# Altium project Top.PrjPCB
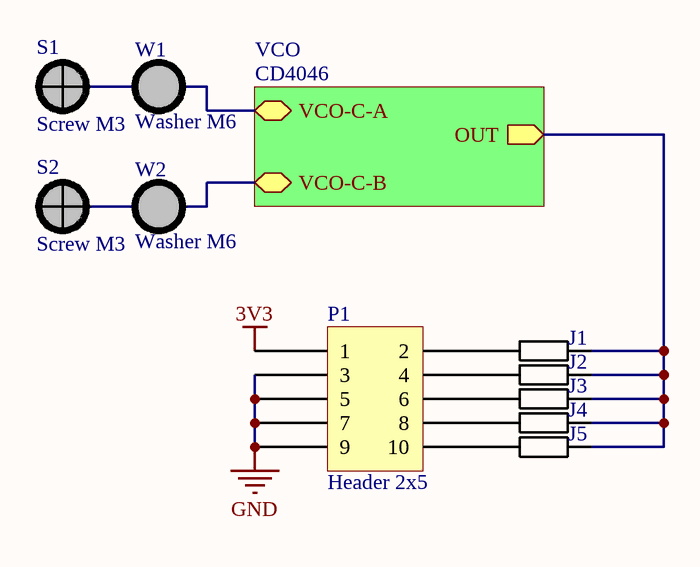
[diagram p0: Top.SchDoc]
2 sheets, 14 parts. Net scope: hierarchical (ports join the sheet entries above them; power ports are global).
Board files: PCB.PcbDoc, Multi-Nutzen.PcbDoc, Multi-Nutzen 2x3.PcbDoc, Multi-Nutzen 39.PcbDoc, Multi-Nutzen 4+3+6+2.PcbDoc
Sheets:
  Top.SchDoc
    CD4046 = VCO.SchDoc

## Sheet Top.SchDoc
size A4

### Parts
J1  (no value)  [R 0805 / 2012 wide]
J2  (no value)  [R 0805 / 2012 wide]
J3  (no value)  [R 0805 / 2012 wide]
J4  (no value)  [R 0805 / 2012 wide]
J5  (no value)  [R 0805 / 2012 wide]
P1  Header 2x5  [Header 2x5 IDC-10S]
S1  Screw M3  [Screw M3]
S2  Screw M3  [Screw M3]
W1  Washer M6  [Washer M6]
W2  Washer M6  [Washer M6]

### Sub-sheets
CD4046 = VCO: VCO-C-A (bidir), VCO-C-B (bidir), OUT (out)

### Nets
3V3: P1.1
GND: P1.3 P1.5 P1.7 P1.9
Frequency-Out: J1.2 J2.2 J3.2 J4.2 J5.2 ; sheet CD4046/OUT
NetJ1_1: J1.1 P1.2
NetJ2_1: J2.1 P1.4
NetJ3_1: J3.1 P1.6
NetJ4_1: J4.1 P1.8
NetJ5_1: J5.1 P1.10

### Library data of the parts
J1-J5 = Resistor

## Sheet VCO.SchDoc
size A4
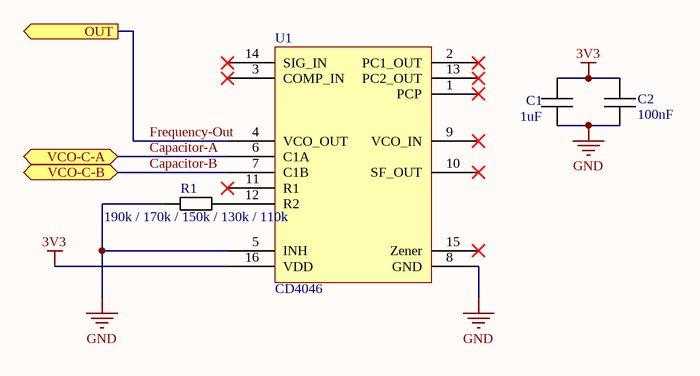
[diagram p1: VCO.SchDoc]

### Parts
C1  1uF  [C 0805 / 2012]
C2  100nF  [C 0805 / 2012]
R1  190k / 170k / 150k / 130k / 110k  [R 0805 / 2012]
U1  CD4046  [SOIC-16]

### Ports
OUT (out), VCO-C-A (bidir), VCO-C-B (bidir)

### Nets
3V3: C1.1 C2.1 U1.16(VDD)
GND: C1.2 C2.2 R1.2 U1.5(INH) U1.8(GND)
Capacitor-A: U1.6(C1A) ; port VCO-C-A
Capacitor-B: U1.7(C1B) ; port VCO-C-B
Frequency-Out: U1.4(VCO_OUT) ; port OUT
NetR1_1: R1.1 U1.12(R2)

Not connected (* = marked no-connect by the designer): U1 1(PCP)* 2(PC1_OUT)* 3(COMP_IN)* 9(VCO_IN)* 10(SF_OUT)* 11(R1)* 13(PC2_OUT)* 14(SIG_IN)* 15(Zener)*

### Library data of the parts
C1 C2 = Capacitor
R1 = Resistor
U1 = CD4046: PLL / VCO

## Nets that join several sheets
3V3: Top (P1.1), VCO (C1.1 C2.1 U1.16)
GND: Top (P1.3 P1.5 P1.7 P1.9), VCO (5 pins)
Frequency-Out: Top (5 pins), VCO (U1.4)